# EasyEDA Pro project MacroPadTouch-ESP32.eprj

# Schematic MacroPadTouch-ESP32
Board Name: Board1; Create Date: 2025-01-21; Page Name: MacroPadTouch-ESP32; Project Name: MacroPadTouch-ESP32; Schematic Name: MacroPadTouch-ESP32; Update Date: 2025-02-02; Add into BOM: yes; Convert to PCB: yes
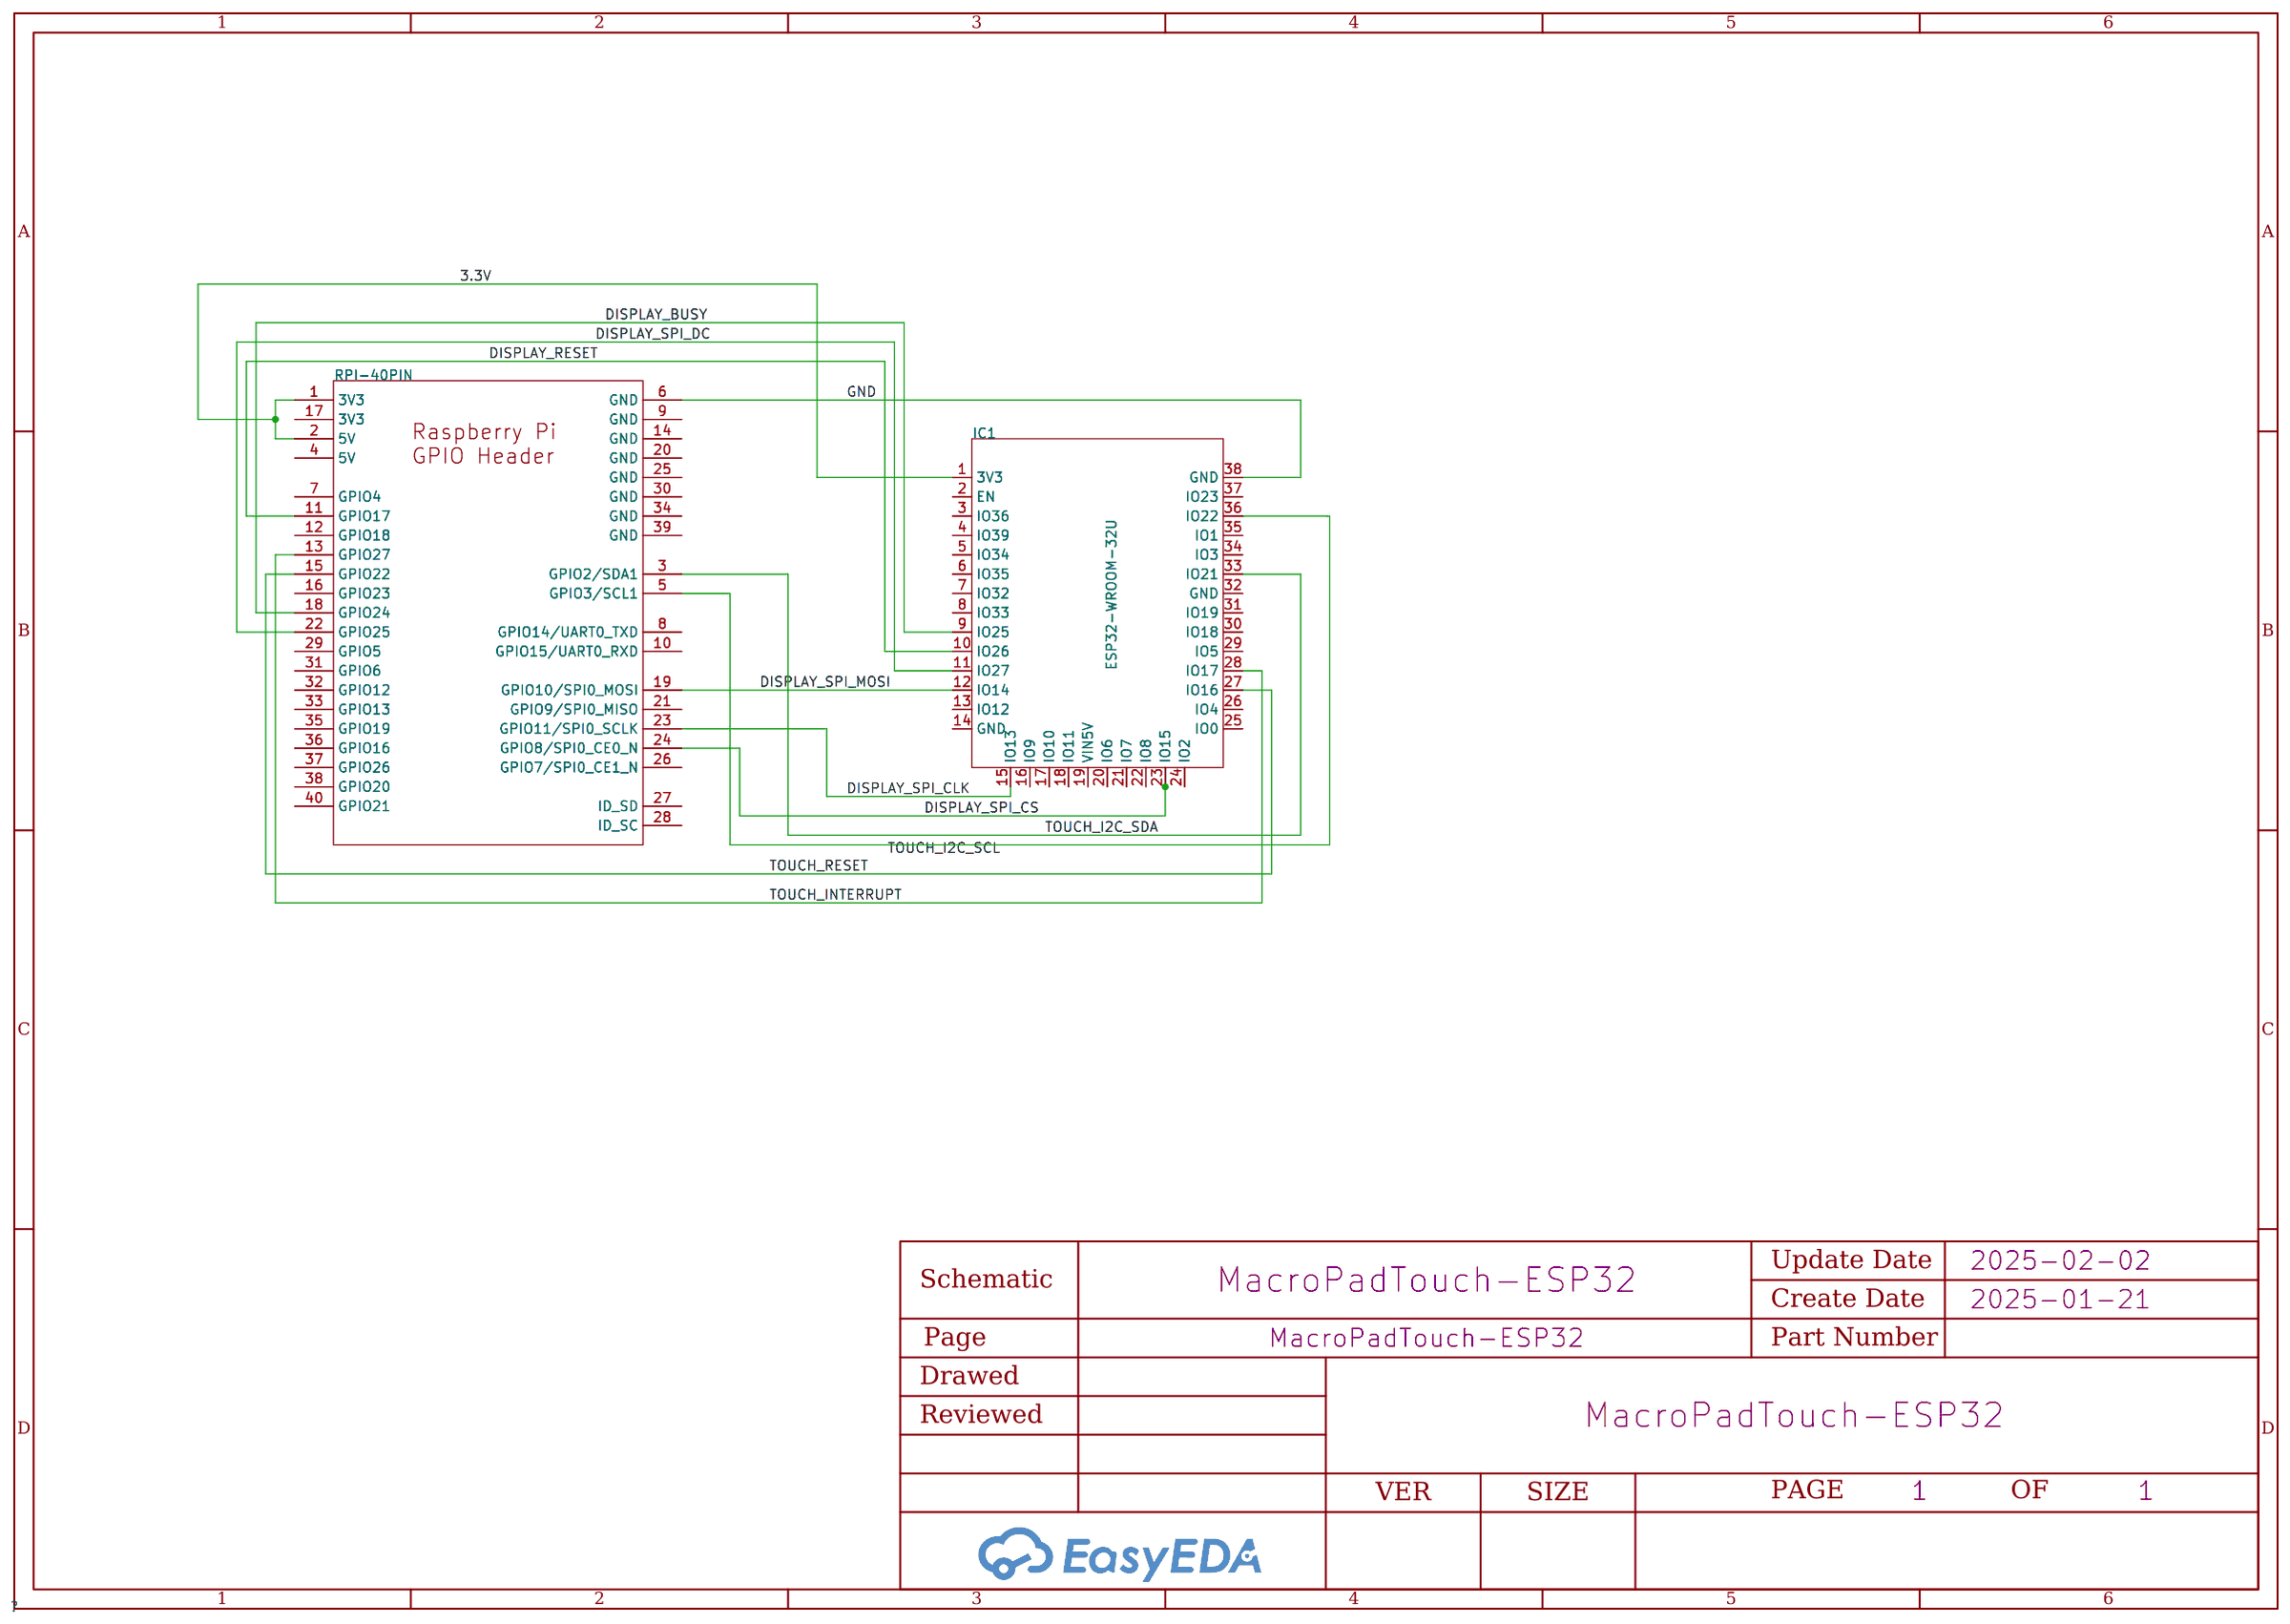
[diagram p0: schematic sheet]

## Parts
IC1  ESP32-WROOM-32U  [ESP32-WROOM-32U]
RPI-40PIN  -  [RASPBERRY_PI_GPIO_HEADER]

## Library data of the parts
IC1 = ESP32-WROOM-32U
RPI-40PIN = Raspberry Pi GPIO Header

## Nets
3.3V: IC1.1(3V3) RPI-40PIN.1(3V3) RPI-40PIN.2(5V)
GND: IC1.38(GND) RPI-40PIN.6(GND)
DISPLAY_BUSY: IC1.9(IO25) RPI-40PIN.18(GPIO24)
DISPLAY_RESET: IC1.10(IO26) RPI-40PIN.11(GPIO17)
DISPLAY_SPI_CLK: IC1.15(IO13) RPI-40PIN.23(GPIO11/SPI0_SCLK)
DISPLAY_SPI_CS: IC1.23(IO15) RPI-40PIN.24(GPIO8/SPI0_CE0_N)
DISPLAY_SPI_DC: IC1.11(IO27) RPI-40PIN.22(GPIO25)
DISPLAY_SPI_MOSI: IC1.12(IO14) RPI-40PIN.19(GPIO10/SPI0_MOSI)
TOUCH_I2C_SCL: IC1.36(IO22) RPI-40PIN.5(GPIO3/SCL1)
TOUCH_I2C_SDA: IC1.33(IO21) RPI-40PIN.3(GPIO2/SDA1)
TOUCH_INTERRUPT: IC1.28(IO17) RPI-40PIN.13(GPIO27)
TOUCH_RESET: IC1.27(IO16) RPI-40PIN.15(GPIO22)

Not connected (* = marked no-connect by the designer): IC1 2(EN) 3(IO36) 4(IO39) 5(IO34) 6(IO35) 7(IO32) 8(IO33) 13(IO12) 14(GND) 16(IO9) 17(IO10) 18(IO11) 19(VIN5V) 20(IO6) 21(IO7) 22(IO8) 24(IO2) 25(IO0) 26(IO4) 29(IO5) 30(IO18) 31(IO19) 32(GND) 34(IO3) 35(IO1) 37(IO23); RPI-40PIN 4(5V) 7(GPIO4) 8(GPIO14/UART0_TXD) 9(GND) 10(GPIO15/UART0_RXD) 12(GPIO18) 14(GND) 16(GPIO23) 17(3V3) 20(GND) 21(GPIO9/SPI0_MISO) 25(GND) 26(GPIO7/SPI0_CE1_N) 27(ID_SD) 28(ID_SC) 29(GPIO5) 30(GND) 31(GPIO6) 32(GPIO12) 33(GPIO13) 34(GND) 35(GPIO19) 36(GPIO16) 37(GPIO26) 38(GPIO20) 39(GND) 40(GPIO21)

# Board PCB1
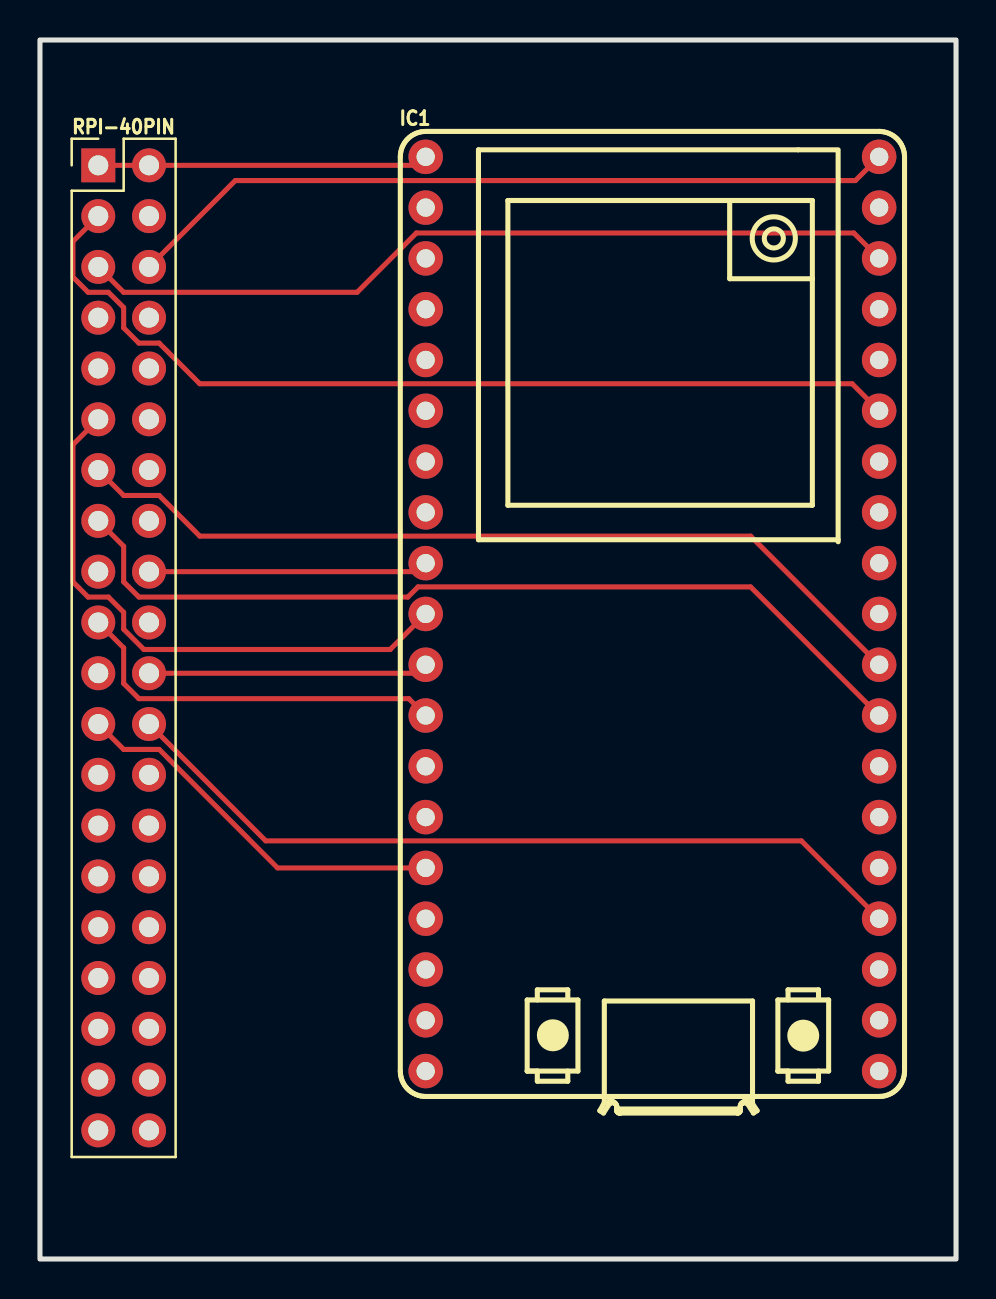
[diagram p1: board, top side]
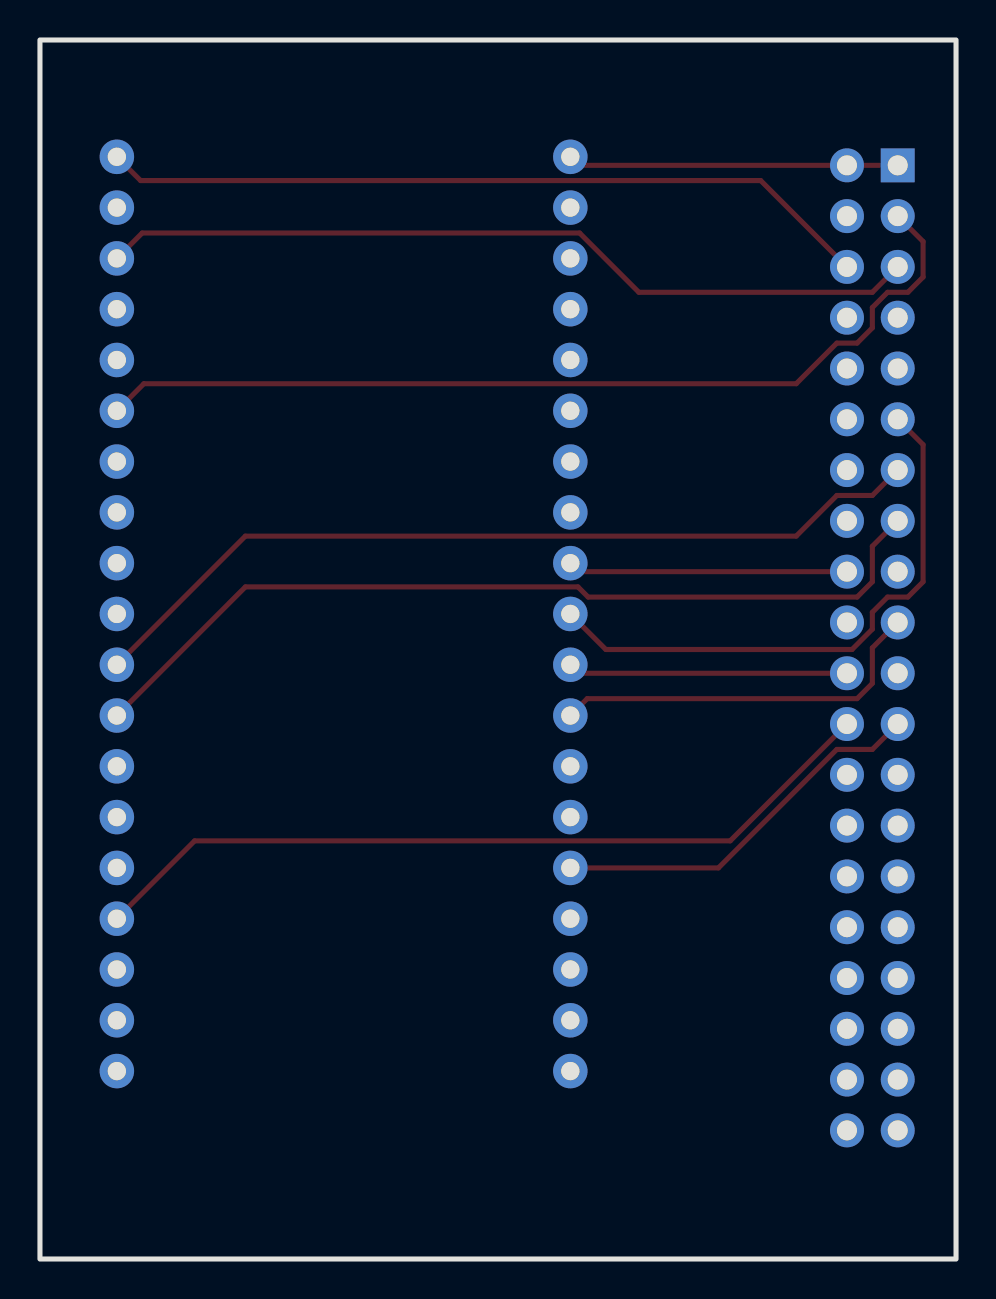
[diagram p2: board, bottom side, seen from below]

Outline 45.85 x 60.96 mm; copper layers: Top Layer, Bottom Layer. Coordinates in mm from the lower left corner of the outline.
Outline path: rectangle 0,60.96 45.85,0
Stack: Top Layer 0.035mm / Dielectric1 1.51mm FR4 er 4.5 / Bottom Layer 0.035mm

## Design rules (mm)
template: JLCPCB Capability(Two Layers Board)
spacing copperThickness1oz (default): track to track 0.102, other pairs 0.152 to 0.3
spacing copperThickness2oz: track to track 0.203, other pairs 0.152 to 0.3
track width copperThickness1oz (default): min 0.127, default 0.254, max 2.54
track width copperThickness2oz: min 0.203, default 0.254, max 2.54
differential pair differentialPair (default): width min 0.127, default 0.254, max 2.54; gap min 0.152, default 0.152
via viaSize (default): diameter min 0.5, default 0.61, max 10; hole min 0.3, default 0.305, max 6.3
net GND uses copperThickness2oz
net 3.3V uses copperThickness2oz

## Placement (name value [footprint] x y rotation side)
IC1  -  [ESP32-WROOM-32U]  33.15 30.61 0 top
RPI-40PIN  -  [RASPBERRY_PI_GPIO_HEADER]  1.65 55.96 0 top

## Footprints (pads in the part's own frame, mm; a bottom-side part is the same pattern mirrored in y, then rotated)
ESP32-WROOM-32U
  round 1.727 hole 0.914: 1(-13.843,24.511) 2(-13.843,21.971) 3(-13.843,19.431) 4(-13.843,16.891) 5(-13.843,14.351) 6(-13.843,11.811) 7(-13.843,9.271) 8(-13.843,6.731) 9(-13.843,4.191) 10(-13.843,1.651) 11(-13.843,-0.889) 12(-13.843,-3.429) 13(-13.843,-5.969) 14(-13.843,-8.509) 15(-13.843,-11.049) 16(-13.843,-13.589) 17(-13.843,-16.129) 18(-13.843,-18.669) 19(-13.843,-21.209) 20(8.852,-21.209) 21(8.852,-18.669) 22(8.852,-16.129) 23(8.852,-13.589) 24(8.852,-11.049) 25(8.852,-8.509) 26(8.852,-5.969) 27(8.852,-3.429) 28(8.852,-0.889) 29(8.852,1.651) 30(8.852,4.191) 31(8.852,6.731) 32(8.852,9.271) 33(8.852,11.811) 34(8.852,14.351) 35(8.852,16.891) 36(8.852,19.431) 37(8.852,21.971) 38(8.852,24.511)
RASPBERRY_PI_GPIO_HEADER
  rect 1.7x1.7 hole 1: 1(1.27,-1.27)
  round 1.7 hole 1: 2(3.81,-1.27) 3(1.27,-3.81) 4(3.81,-3.81) 5(1.27,-6.35) 6(3.81,-6.35) 7(1.27,-8.89) 8(3.81,-8.89) 9(1.27,-11.43) 10(3.81,-11.43) 11(1.27,-13.97) 12(3.81,-13.97) 13(1.27,-16.51) 14(3.81,-16.51) 15(1.27,-19.05) 16(3.81,-19.05) 17(1.27,-21.59) 18(3.81,-21.59) 19(1.27,-24.13) 20(3.81,-24.13) 21(1.27,-26.67) 22(3.81,-26.67) 23(1.27,-29.21) 24(3.81,-29.21) 25(1.27,-31.75) 26(3.81,-31.75) 27(1.27,-34.29) 28(3.81,-34.29) 29(1.27,-36.83) 30(3.81,-36.83) 31(1.27,-39.37) 32(3.81,-39.37) 33(1.27,-41.91) 34(3.81,-41.91) 35(1.27,-44.45) 36(3.81,-44.45) 37(1.27,-46.99) 38(3.81,-46.99) 39(1.27,-49.53) 40(3.81,-49.53)

## Nets
As in the schematic.

Pads without a net: IC1 2 3 4 5 6 7 8 13 14 16 17 18 19 20 21 22 24 25 26 29 30 31 32 34 35 37; RPI-40PIN 4 7 8 9 10 12 14 16 17 20 21 25 26 27 28 29 30 31 32 33 34 35 36 37 38 39 40

## Routing (per net, layer and track width the routed paths; a pad name or vN(x,y) marks a point on that pad's centre or on a via; arc(x,y) is an arc through that point)
3.3V: length 16.6
  Top Layer w0.254: 19.3,55.12 18.88,54.69 RPI-40PIN.2 RPI-40PIN.1
GND: length 38.8
  Top Layer w0.254: RPI-40PIN.6 9.78,53.93 40.81,53.93 42,55.12
DISPLAY_BUSY: length 14
  Top Layer w0.254: IC1.9 18.88,34.37 RPI-40PIN.18
DISPLAY_RESET: length 28.9
  Top Layer w0.254: 19.3,32.26 17.53,30.48 5.2,30.48 4.19,31.5 4.19,32.34 3.43,33.1 2.41,33.1 1.65,33.86 1.65,40.72 RPI-40PIN.11
DISPLAY_SPI_CLK: length 19.4
  Top Layer w0.254: RPI-40PIN.23 4.19,25.48 5.97,25.48 11.89,19.56 IC1.15
DISPLAY_SPI_CS: length 40.6
  Top Layer w0.254: RPI-40PIN.24 11.3,20.91 38.11,20.91 IC1.23
DISPLAY_SPI_DC: length 14
  Top Layer w0.254: IC1.11 18.88,29.29 RPI-40PIN.22
DISPLAY_SPI_MOSI: length 19.4
  Top Layer w0.254: RPI-40PIN.19 4.19,30.56 4.19,28.78 4.95,28.02 18.46,28.02 IC1.12
TOUCH_I2C_SCL: length 41.4
  Top Layer w0.254: RPI-40PIN.5 4.19,48.34 15.87,48.34 18.84,51.31 40.73,51.31 IC1.36
TOUCH_I2C_SDA: length 47.3
  Top Layer w0.254: RPI-40PIN.3 1.65,50.88 1.65,49.1 2.41,48.34 3.43,48.34 4.19,47.58 4.19,46.56 4.95,45.8 5.97,45.8 8,43.77 40.65,43.77 42,42.42
TOUCH_INTERRUPT: length 43.1
  Top Layer w0.254: RPI-40PIN.13 4.19,38.18 5.97,38.18 8,36.15 35.57,36.15 IC1.28
TOUCH_RESET: length 44.6
  Top Layer w0.254: RPI-40PIN.15 4.19,35.64 4.19,33.86 4.95,33.1 18.41,33.1 18.92,33.61 35.57,33.61 IC1.27
